# Altium schematic sheet Sheet1.SchDoc
size A4
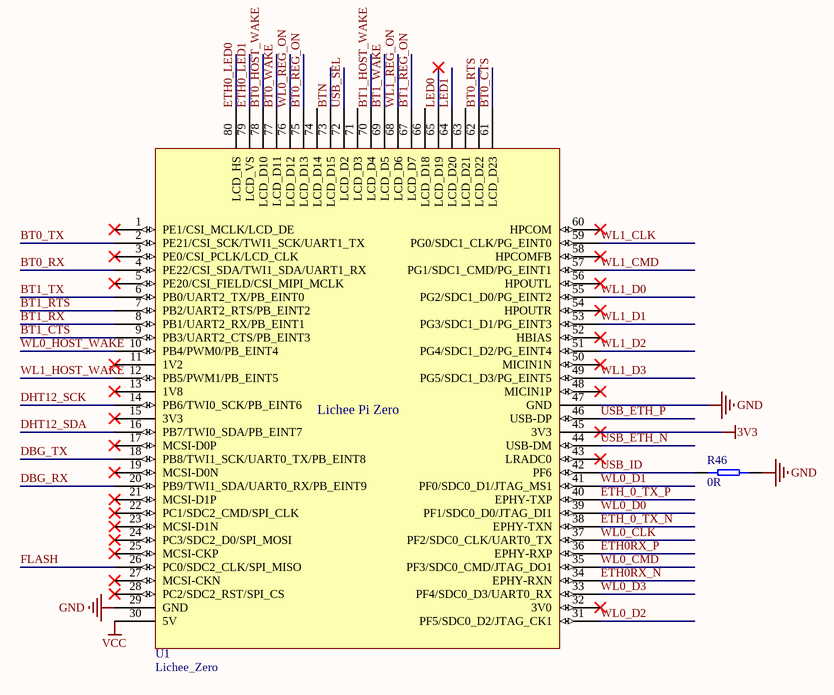
[diagram p0: Sheet1.SchDoc]

## Parts
R46  0R  [0805R]
U1  Lichee_Zero  [Lichee_Zero_Full]

## Nets
3V3: U1.45(3V3)
GND: R46.2 U1.29(GND) U1.47(GND)
VCC: U1.30(5V)
BT0_CTS: U1.61(LCD_D23)
BT0_HOST_WAKE: U1.78(LCD_D10)
BT0_REG_ON: U1.75(LCD_D13)
BT0_RTS: U1.62(LCD_D22)
BT0_RX: U1.4(PE22/CSI_SDA/TWI1_SDA/UART1_RX)
BT0_TX: U1.2(PE21/CSI_SCK/TWI1_SCK/UART1_TX)
BT0_WAKE: U1.77(LCD_D11)
BT1_CTS: U1.9(PB3/UART2_CTS/PB_EINT3)
BT1_HOST_WAKE: U1.70(LCD_D4)
BT1_REG_ON: U1.67(LCD_D7)
BT1_RTS: U1.7(PB2/UART2_RTS/PB_EINT2)
BT1_RX: U1.8(PB1/UART2_RX/PB_EINT1)
BT1_TX: U1.6(PB0/UART2_TX/PB_EINT0)
BT1_WAKE: U1.69(LCD_D5)
BTN: U1.73(LCD_D15)
DBG_RX: U1.20(PB9/TWI1_SDA/UART0_RX/PB_EINT9)
DBG_TX: U1.18(PB8/TWI1_SCK/UART0_TX/PB_EINT8)
DHT12_SCK: U1.14(PB6/TWI0_SCK/PB_EINT6)
DHT12_SDA: U1.16(PB7/TWI0_SDA/PB_EINT7)
ETH0_LED0: U1.80(LCD_HS)
ETH0_LED1: U1.79(LCD_VS)
ETH0RX_N: U1.34(EPHY-RXN)
ETH0RX_P: U1.36(EPHY-RXP)
ETH_0_TX_N: U1.38(EPHY-TXN)
ETH_0_TX_P: U1.40(EPHY-TXP)
FLASH: U1.26(PC0/SDC2_CLK/SPI_MISO)
LED0: U1.65(LCD_D19)
LED1: U1.64(LCD_D20)
USB_ETH_N: U1.44(USB-DM)
USB_ETH_P: U1.46(USB-DP)
USB_ID: R46.1 U1.42(PF6)
USB_SEL: U1.72(LCD_D2)
WL0_CLK: U1.37(PF2/SDC0_CLK/UART0_TX)
WL0_CMD: U1.35(PF3/SDC0_CMD/JTAG_DO1)
WL0_D0: U1.39(PF1/SDC0_D0/JTAG_DI1)
WL0_D1: U1.41(PF0/SDC0_D1/JTAG_MS1)
WL0_D2: U1.31(PF5/SDC0_D2/JTAG_CK1)
WL0_D3: U1.33(PF4/SDC0_D3/UART0_RX)
WL0_HOST_WAKE: U1.10(PB4/PWM0/PB_EINT4)
WL0_REG_ON: U1.76(LCD_D12)
WL1_CLK: U1.59(PG0/SDC1_CLK/PG_EINT0)
WL1_CMD: U1.57(PG1/SDC1_CMD/PG_EINT1)
WL1_D0: U1.55(PG2/SDC1_D0/PG_EINT2)
WL1_D1: U1.53(PG3/SDC1_D1/PG_EINT3)
WL1_D2: U1.51(PG4/SDC1_D2/PG_EINT4)
WL1_D3: U1.49(PG5/SDC1_D3/PG_EINT5)
WL1_HOST_WAKE: U1.12(PB5/PWM1/PB_EINT5)
WL1_REG_ON: U1.68(LCD_D6)

Not connected (* = marked no-connect by the designer): U1 1(PE1/CSI_MCLK/LCD_DE)* 3(PE0/CSI_PCLK/LCD_CLK)* 5(PE20/CSI_FIELD/CSI_MIPI_MCLK)* 11(1V2)* 13(1V8)* 15(3V3)* 17(MCSI-D0P)* 19(MCSI-D0N)* 21(MCSI-D1P)* 22(PC1/SDC2_CMD/SPI_CLK)* 23(MCSI-D1N)* 24(PC3/SDC2_D0/SPI_MOSI)* 25(MCSI-CKP)* 27(MCSI-CKN)* 28(PC2/SDC2_RST/SPI_CS)* 32(3V0)* 43(LRADC0)* 48(MICIN1P)* 50(MICIN1N)* 52(HBIAS)* 54(HPOUTR)* 56(HPOUTL)* 58(HPCOMFB)* 60(HPCOM)* 63(LCD_D21) 66(LCD_D18) 71(LCD_D3) 74(LCD_D14)

## Notes on the sheet
- (in symbol Lichee_Zero_Full) Lichee Pi Zero

## Library data of the parts
R46 = R
U1 = Lichee_Zero_Full: Lichee_pizero LPZ1011